# Altium schematic sheet [09] HDMI.SchDoc: HDMI Interface
size A4; Engineer: M. Folejewski; DocumentNumber: 9; SheetNumber: 9; SheetTotal: 17; PageSize: A4; Designators: 400-449
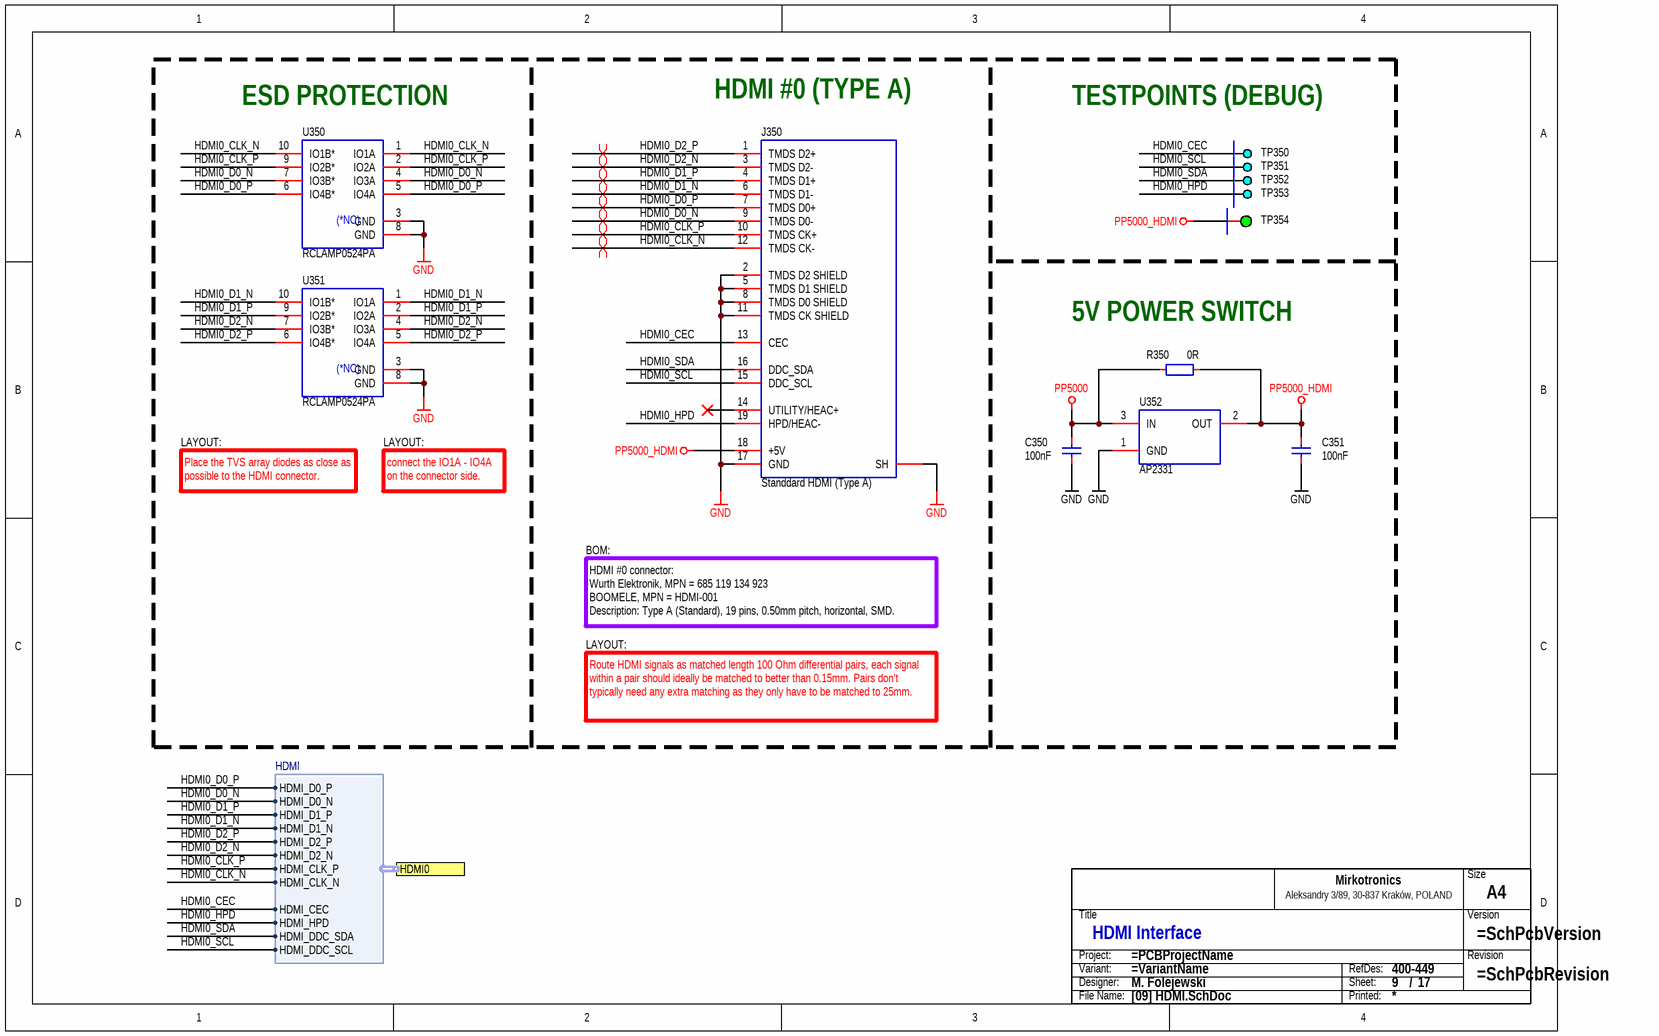
[diagram p0: [09] HDMI.SchDoc]

## Parts
C350  100nF  [CAP_0603_R]
C351  100nF  [CAP_0603_R]
J350  Standdard HDMI (Type A)  [CON_HDMI_STD]
R350  0R  [RES_0603_R]
TB?  Title block  (value not drawn)  (graphical)
TP350  DEBUG  [PCB_TP_DBG_50]  (value not drawn)  (no BOM)
TP351  DEBUG  [PCB_TP_DBG_50]  (value not drawn)  (no BOM)
TP352  DEBUG  [PCB_TP_DBG_50]  (value not drawn)  (no BOM)
TP353  DEBUG  [PCB_TP_DBG_50]  (value not drawn)  (no BOM)
TP354  ICT  [PCB_TP_ICT_100]  (value not drawn)  (no BOM)
U350  RCLAMP0524PA  [ICC_SLP2510P8_250X100X60_P50_R]
U351  RCLAMP0524PA  [ICC_SLP2510P8_250X100X60_P50_R]
U352  AP2331  [PKG_SOT23-3L_SC59_P190_R]

## Ports
HDMI0 (harness HDMI)

## Harnesses
HDMI: HDMI_D0_P, HDMI_D0_N, HDMI_D1_P, HDMI_D1_N, HDMI_CEC, HDMI_DDC_SDA, HDMI_D2_P, HDMI_D2_N, HDMI_CLK_P, HDMI_CLK_N, HDMI_DDC_SCL, HDMI_HPD

## Nets
GND: C350.1 C351.1 J350.2(TMDS_D2_SHIELD) J350.5(TMDS_D1_SHIELD) J350.8(TMDS_D0_SHIELD) J350.11(TMDS_CK_SHIELD) J350.17(GND) J350.SH U350.3(GND) U350.8(GND) U351.3(GND) U351.8(GND) U352.1(GND)
PP5000: C350.2 R350.2 U352.3(IN)
PP5000_HDMI: C351.2 J350.18(+5V) R350.1 TP354.1 U352.2(OUT)
HDMI0_CEC: J350.13(CEC) TP350.1 ; port HDMI0.HDMI_CEC
HDMI0_CLK_N: J350.12(TMDS_CK-) U350.1(IO1A) U350.10(IO1B*) ; port HDMI0.HDMI_CLK_N
HDMI0_CLK_P: J350.10(TMDS_CK+) U350.2(IO2A) U350.9(IO2B*) ; port HDMI0.HDMI_CLK_P
HDMI0_D0_N: J350.9(TMDS_D0-) U350.4(IO3A) U350.7(IO3B*) ; port HDMI0.HDMI_D0_N
HDMI0_D0_P: J350.7(TMDS_D0+) U350.5(IO4A) U350.6(IO4B*) ; port HDMI0.HDMI_D0_P
HDMI0_D1_N: J350.6(TMDS_D1-) U351.1(IO1A) U351.10(IO1B*) ; port HDMI0.HDMI_D1_N
HDMI0_D1_P: J350.4(TMDS_D1+) U351.2(IO2A) U351.9(IO2B*) ; port HDMI0.HDMI_D1_P
HDMI0_D2_N: J350.3(TMDS_D2-) U351.4(IO3A) U351.7(IO3B*) ; port HDMI0.HDMI_D2_N
HDMI0_D2_P: J350.1(TMDS_D2+) U351.5(IO4A) U351.6(IO4B*) ; port HDMI0.HDMI_D2_P
HDMI0_HPD: J350.19(HPD/HEAC-) TP353.1 ; port HDMI0.HDMI_HPD
HDMI0_SCL: J350.15(DDC_SCL) TP351.1 ; port HDMI0.HDMI_DDC_SCL
HDMI0_SDA: J350.16(DDC_SDA) TP352.1 ; port HDMI0.HDMI_DDC_SDA

Not connected (* = marked no-connect by the designer): J350 14(UTILITY/HEAC+)*

## Layout directives
differential pair: HDMI0_CLK_N, HDMI0_CLK_P, HDMI0_D0_N, HDMI0_D0_P, HDMI0_D1_N, HDMI0_D1_P, HDMI0_D2_N, HDMI0_D2_P

## Notes on the sheet
- (near U350) ESD PROTECTION
- (near J350) HDMI #0 (TYPE A)
- TESTPOINTS (DEBUG)
- (near R350) 5V POWER SWITCH
- LAYOUT:
- Place the TVS array diodes as close as possible to the HDMI connector.
- connect the IO1A - IO4A on the connector side.
- BOM:
- HDMI #0 connector:
  Wurth Elektronik, MPN = 685 119 134 923
  BOOMELE, MPN = HDMI-001
  Description: Type A (Standard), 19 pins, 0.50mm pitch, horizontal, SMD.
- Route HDMI signals as matched length 100 Ohm differential pairs, each signal within a pair should ideally be matched to better than 0.15mm. Pairs don’t typically need any extra matching as they only have to be matched to 25mm.
- (in symbol ICC-0005) (*NC)
- (in symbol SCH_TITLE_BLOCK_MIRKOTRONICS_V2) Size; Mirkotronics; Aleksandry 3/89, 30-837 Kraków, POLAND; Title; Version; Project:; Revision; Variant:; RefDes:; Designer:; Sheet:; /; File Name:; Printed:

## Library data of the parts
C350 C351 = CAP-0008: Capacitor; MLCC; 100nF; TBD; TBD; TBD; TBD; SMD; 0603 (1608);; Component Type: Capacitor; Component Subtype: MLCC; Value: 100nF; Manufacturer: TBD; MPN: TBD; Mounting Type: SMD; Package (Case): 0603 (1608); Supplier: ?; Supplier 1: LCSC; Supplier Part Number 1: C14663
J350 = CON_HDMI_1.4+_A2: Connector; HDMI v1.4+;; MPN: HDMI-001; Manufacturer: BOOMELE; Package (Case): SMD; Value: Standdard HDMI (Type A); Component Subtype: HDMI (Type A); Component Type: Connector; Mounting Type: SMD; Supplier: ?; Supplier 1: LCSC; Supplier Part Number 1: C138388
R350 = RES-0054: Resistor; Thick Film; GENERIC; TBD; TBD; TBD; TBD; TBD; SMD; 0603 (1608);; Component Type: Resistor; Component Subtype: Thick Film; Value: 0R; Manufacturer: GENERIC; MPN: GENERIC; Mounting Type: SMD; Package (Case): 0603 (1608); Supplier: ?; Supplier 1: LCSC; Supplier Part Number 1: C21189
TB? = SCH_TITLE_BLOCK_MIRKOTRONICS_V2: Component Type: Title block; Manufacturer: -; Mounting Type: Non component; MPN: -; Operating Temperature: -; Package: -; Specification: Title block; Value: Title block; Replacement: -; System: ?
TP350-TP353 = PCB_TP_DBG: PCB Marking; Test Point (Debug);; Value: DEBUG; Component Subtype: -; Component Type: Testpoint; Mounting Type: -; Supplier: ?
TP354 = PCB_TP_ICT: Test Point (ICT); Specification: Testpoint (for ICT), SMD pad; Component Type: Testpoint (for ICT); Manufacturer: -; Mounting Type: Non component; MPN: -; Value: ICT
U350 U351 = ICC-0005: IC; TVS Arrays; ESD Protection; 4-Channel; 17kV Air; 12kV Contact; 0.3pF Capitance; TBD; SMD; TBD;; Manufacturer: Semtech Corporation; MPN: RCLAMP0524PATCT; Component Type: IC; Component Subtype: TVS Arrays; Value: RCLAMP0524PA; Mounting Type: SMD; Package (Case): TBD; Supplier: ?; Supplier 1: LCSC; Supplier Part Number 1: C40960
U352 = ICC-0008: IC; Power Switcher; TBD TBD; SMD; SC59;; Manufacturer: Diodes Incorporated; MPN: AP2331W-7; Component Type: IC; Component Subtype: Power Switcher; Value: AP2331; Mounting Type: SMD; Package (Case): SC59; Supplier: ?; Supplier 1: LCSC; Supplier Part Number 1: C460346